# EAGLE schematic TermProject (EAGLE 9.6.1)

## Sheet 1 of 2
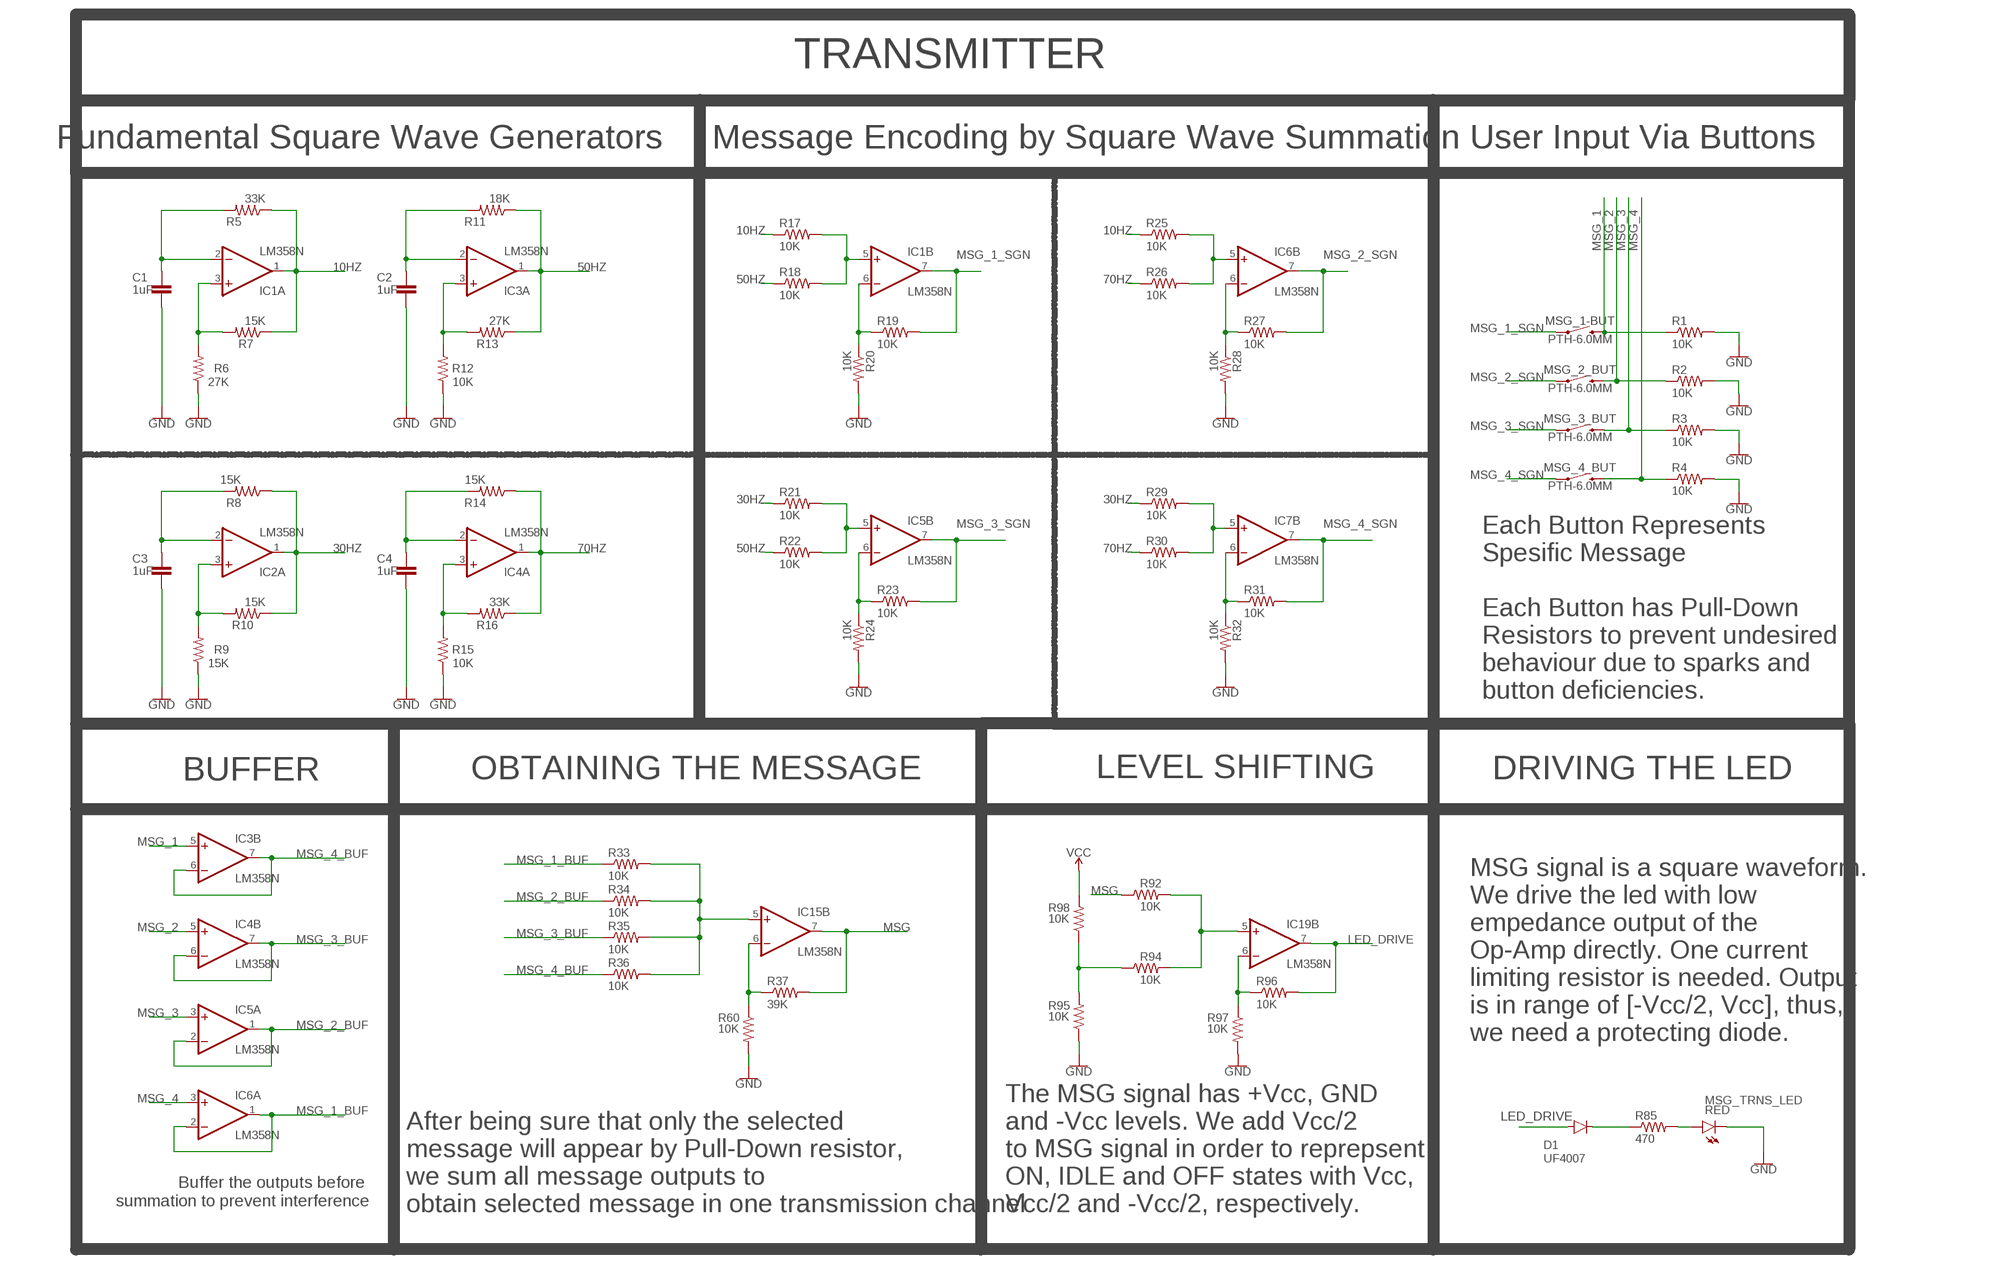
[diagram p0: schematic, sheet 1]

### Parts
C1  1uF  C-EU075-052X106  [C075-052X106]
C2  1uF  C-EU075-052X106  [C075-052X106]
C3  1uF  C-EU075-052X106  [C075-052X106]
C4  1uF  C-EU075-052X106  [C075-052X106]
D1  UF4007  1N4148DO35-7  [DO35-7]
IC1  LM358N  [DIL08]
IC2  LM358N  [DIL08]
IC3  LM358N  [DIL08]
IC4  LM358N  [DIL08]
IC5  LM358N  [DIL08]
IC6  LM358N  [DIL08]
IC7  LM358N  [DIL08]
IC15  LM358N  [DIL08]
IC19  LM358N  [DIL08]
MSG_1-BUT  PTH-6.0MM  MOMENTARY-SWITCH-SPST-PTH-6.0MM  [TACTILE_SWITCH_PTH_6.0MM]
MSG_2_BUT  PTH-6.0MM  MOMENTARY-SWITCH-SPST-PTH-6.0MM  [TACTILE_SWITCH_PTH_6.0MM]
MSG_3_BUT  PTH-6.0MM  MOMENTARY-SWITCH-SPST-PTH-6.0MM  [TACTILE_SWITCH_PTH_6.0MM]
MSG_4_BUT  PTH-6.0MM  MOMENTARY-SWITCH-SPST-PTH-6.0MM  [TACTILE_SWITCH_PTH_6.0MM]
MSG_TRNS_LED  RED  LED10MM  [LED_10MM]
R1  10K  R-US_0207/7  [0207/7]
R2  10K  R-US_0207/7  [0207/7]
R3  10K  R-US_0207/7  [0207/7]
R4  10K  R-US_0207/7  [0207/7]
R5  33K  R-US_0207/7  [0207/7]
R6  27K  R-US_0207/7  [0207/7]
R7  15K  R-US_0207/7  [0207/7]
R8  15K  R-US_0207/7  [0207/7]
R9  15K  R-US_0207/7  [0207/7]
R10  15K  R-US_0207/7  [0207/7]
R11  18K  R-US_0207/7  [0207/7]
R12  10K  R-US_0207/7  [0207/7]
R13  27K  R-US_0207/7  [0207/7]
R14  15K  R-US_0207/7  [0207/7]
R15  10K  R-US_0207/7  [0207/7]
R16  33K  R-US_0207/7  [0207/7]
R17  10K  R-US_0207/7  [0207/7]
R18  10K  R-US_0207/7  [0207/7]
R19  10K  R-US_0207/7  [0207/7]
R20  10K  R-US_0207/7  [0207/7]
R21  10K  R-US_0207/7  [0207/7]
R22  10K  R-US_0207/7  [0207/7]
R23  10K  R-US_0207/7  [0207/7]
R24  10K  R-US_0207/7  [0207/7]
R25  10K  R-US_0207/7  [0207/7]
R26  10K  R-US_0207/7  [0207/7]
R27  10K  R-US_0207/7  [0207/7]
R28  10K  R-US_0207/7  [0207/7]
R29  10K  R-US_0207/7  [0207/7]
R30  10K  R-US_0207/7  [0207/7]
R31  10K  R-US_0207/7  [0207/7]
R32  10K  R-US_0207/7  [0207/7]
R33  10K  R-US_0207/7  [0207/7]
R34  10K  R-US_0207/7  [0207/7]
R35  10K  R-US_0207/7  [0207/7]
R36  10K  R-US_0207/7  [0207/7]
R37  39K  R-US_0207/7  [0207/7]
R60  10K  R-US_0207/7  [0207/7]
R85  470  R-US_0207/7  [0207/7]
R92  10K  R-US_0207/7  [0207/7]
R94  10K  R-US_0207/7  [0207/7]
R95  10K  R-US_0207/7  [0207/7]
R96  10K  R-US_0207/7  [0207/7]
R97  10K  R-US_0207/7  [0207/7]
R98  10K  R-US_0207/7  [0207/7]

### Nets
10HZ: IC1.1(A:OUT) R5.1 R7.1 R17.1 R25.1
30HZ: IC2.1(A:OUT) R8.1 R10.1 R21.1 R29.1
50HZ: IC3.1(A:OUT) R11.1 R13.1 R18.1 R22.1
70HZ: IC4.1(A:OUT) R14.1 R16.1 R26.1 R30.1
GND: C1.1 C2.1 C3.1 C4.1 MSG_TRNS_LED.C R1.2 R2.2 R3.2 R4.2 R6.1 R9.1 R12.1 R15.1 R20.2 R24.2 R28.2 R32.2 R60.2 R95.1 R97.2 ; also sheet 2
LED_DRIVE: D1.A IC19.7(B:OUT) R96.2
MSG: IC15.7(B:OUT) R37.2 R92.1
MSG_1: IC3.5(B:+IN) MSG_1-BUT.3 R1.1
MSG_1_BUF: IC6.1(A:OUT) IC6.2(A:-IN) R33.1
MSG_1_SGN: IC1.7(B:OUT) MSG_1-BUT.1 R19.2
MSG_2: IC4.5(B:+IN) MSG_2_BUT.3 R2.1
MSG_2_BUF: IC5.1(A:OUT) IC5.2(A:-IN) R34.1
MSG_2_SGN: IC6.7(B:OUT) MSG_2_BUT.1 R27.2
MSG_3: IC5.3(A:+IN) MSG_3_BUT.3 R3.1
MSG_3_BUF: IC4.6(B:-IN) IC4.7(B:OUT) R35.1
MSG_3_SGN: IC5.7(B:OUT) MSG_3_BUT.1 R23.2
MSG_4: IC6.3(A:+IN) MSG_4_BUT.3 R4.1
MSG_4_BUF: IC3.6(B:-IN) IC3.7(B:OUT) R36.1
MSG_4_SGN: IC7.7(B:OUT) MSG_4_BUT.1 R31.2
N$1: C1.2 IC1.2(A:-IN) R5.2
N$2: C3.2 IC2.2(A:-IN) R8.2
N$3: IC1.3(A:+IN) R6.2 R7.2
N$4: IC2.3(A:+IN) R9.2 R10.2
N$5: C2.2 IC3.2(A:-IN) R11.2
N$6: IC3.3(A:+IN) R12.2 R13.2
N$7: C4.2 IC4.2(A:-IN) R14.2
N$8: IC4.3(A:+IN) R15.2 R16.2
N$9: IC1.5(B:+IN) R17.2 R18.2
N$10: IC1.6(B:-IN) R19.1 R20.1
N$11: IC5.5(B:+IN) R21.2 R22.2
N$12: IC5.6(B:-IN) R23.1 R24.1
N$13: IC6.5(B:+IN) R25.2 R26.2
N$14: IC6.6(B:-IN) R27.1 R28.1
N$15: IC7.5(B:+IN) R29.2 R30.2
N$16: IC7.6(B:-IN) R31.1 R32.1
N$17: D1.C R85.1
N$30: IC15.6(B:-IN) R37.1 R60.1
N$33: IC15.5(B:+IN) R33.2 R34.2 R35.2 R36.2
N$58: MSG_TRNS_LED.A R85.2
N$64: IC19.6(B:-IN) R96.1 R97.1
N$68: R94.1 R95.2 R98.1
N$69: IC19.5(B:+IN) R92.2 R94.2
VCC: R98.2 ; also sheet 2
Unconnected: IC2.5(B:+IN) IC2.6(B:-IN) IC2.7(B:OUT) IC7.1(A:OUT) IC7.2(A:-IN) IC7.3(A:+IN) IC15.1(A:OUT) IC15.2(A:-IN) IC15.3(A:+IN) IC19.1(A:OUT) IC19.2(A:-IN) IC19.3(A:+IN)

### Notes on the sheet
- TRANSMITTER
- Fundamental Square Wave Generators | Message Encoding by Square Wave Summation | User Input Via Buttons
- Each Button Represents 
  Spesific Message
  
  Each Button has Pull-Down 
  Resistors to prevent undesired
  behaviour due to sparks and 
  button deficiencies.
- BUFFER | OBTAINING THE MESSAGE | LEVEL SHIFTING | DRIVING THE LED
- MSG signal is a square waveform. 
  We drive the led with low 
  empedance output of the 
  Op-Amp directly. One current 
  limiting resistor is needed. Output 
  is in range of [-Vcc/2, Vcc], thus, 
  we need a protecting diode.
- Buffer the outputs before 
  summation to prevent interference
- After being sure that only the selected 
  message will appear by Pull-Down resistor, 
  we sum all message outputs to 
  obtain selected message in one transmission channel
- The MSG signal has +Vcc, GND 
  and -Vcc levels. We add Vcc/2
  to MSG signal in order to reprepsent 
  ON, IDLE and OFF states with Vcc, 
  Vcc/2 and -Vcc/2, respectively.

## Sheet 2 of 2
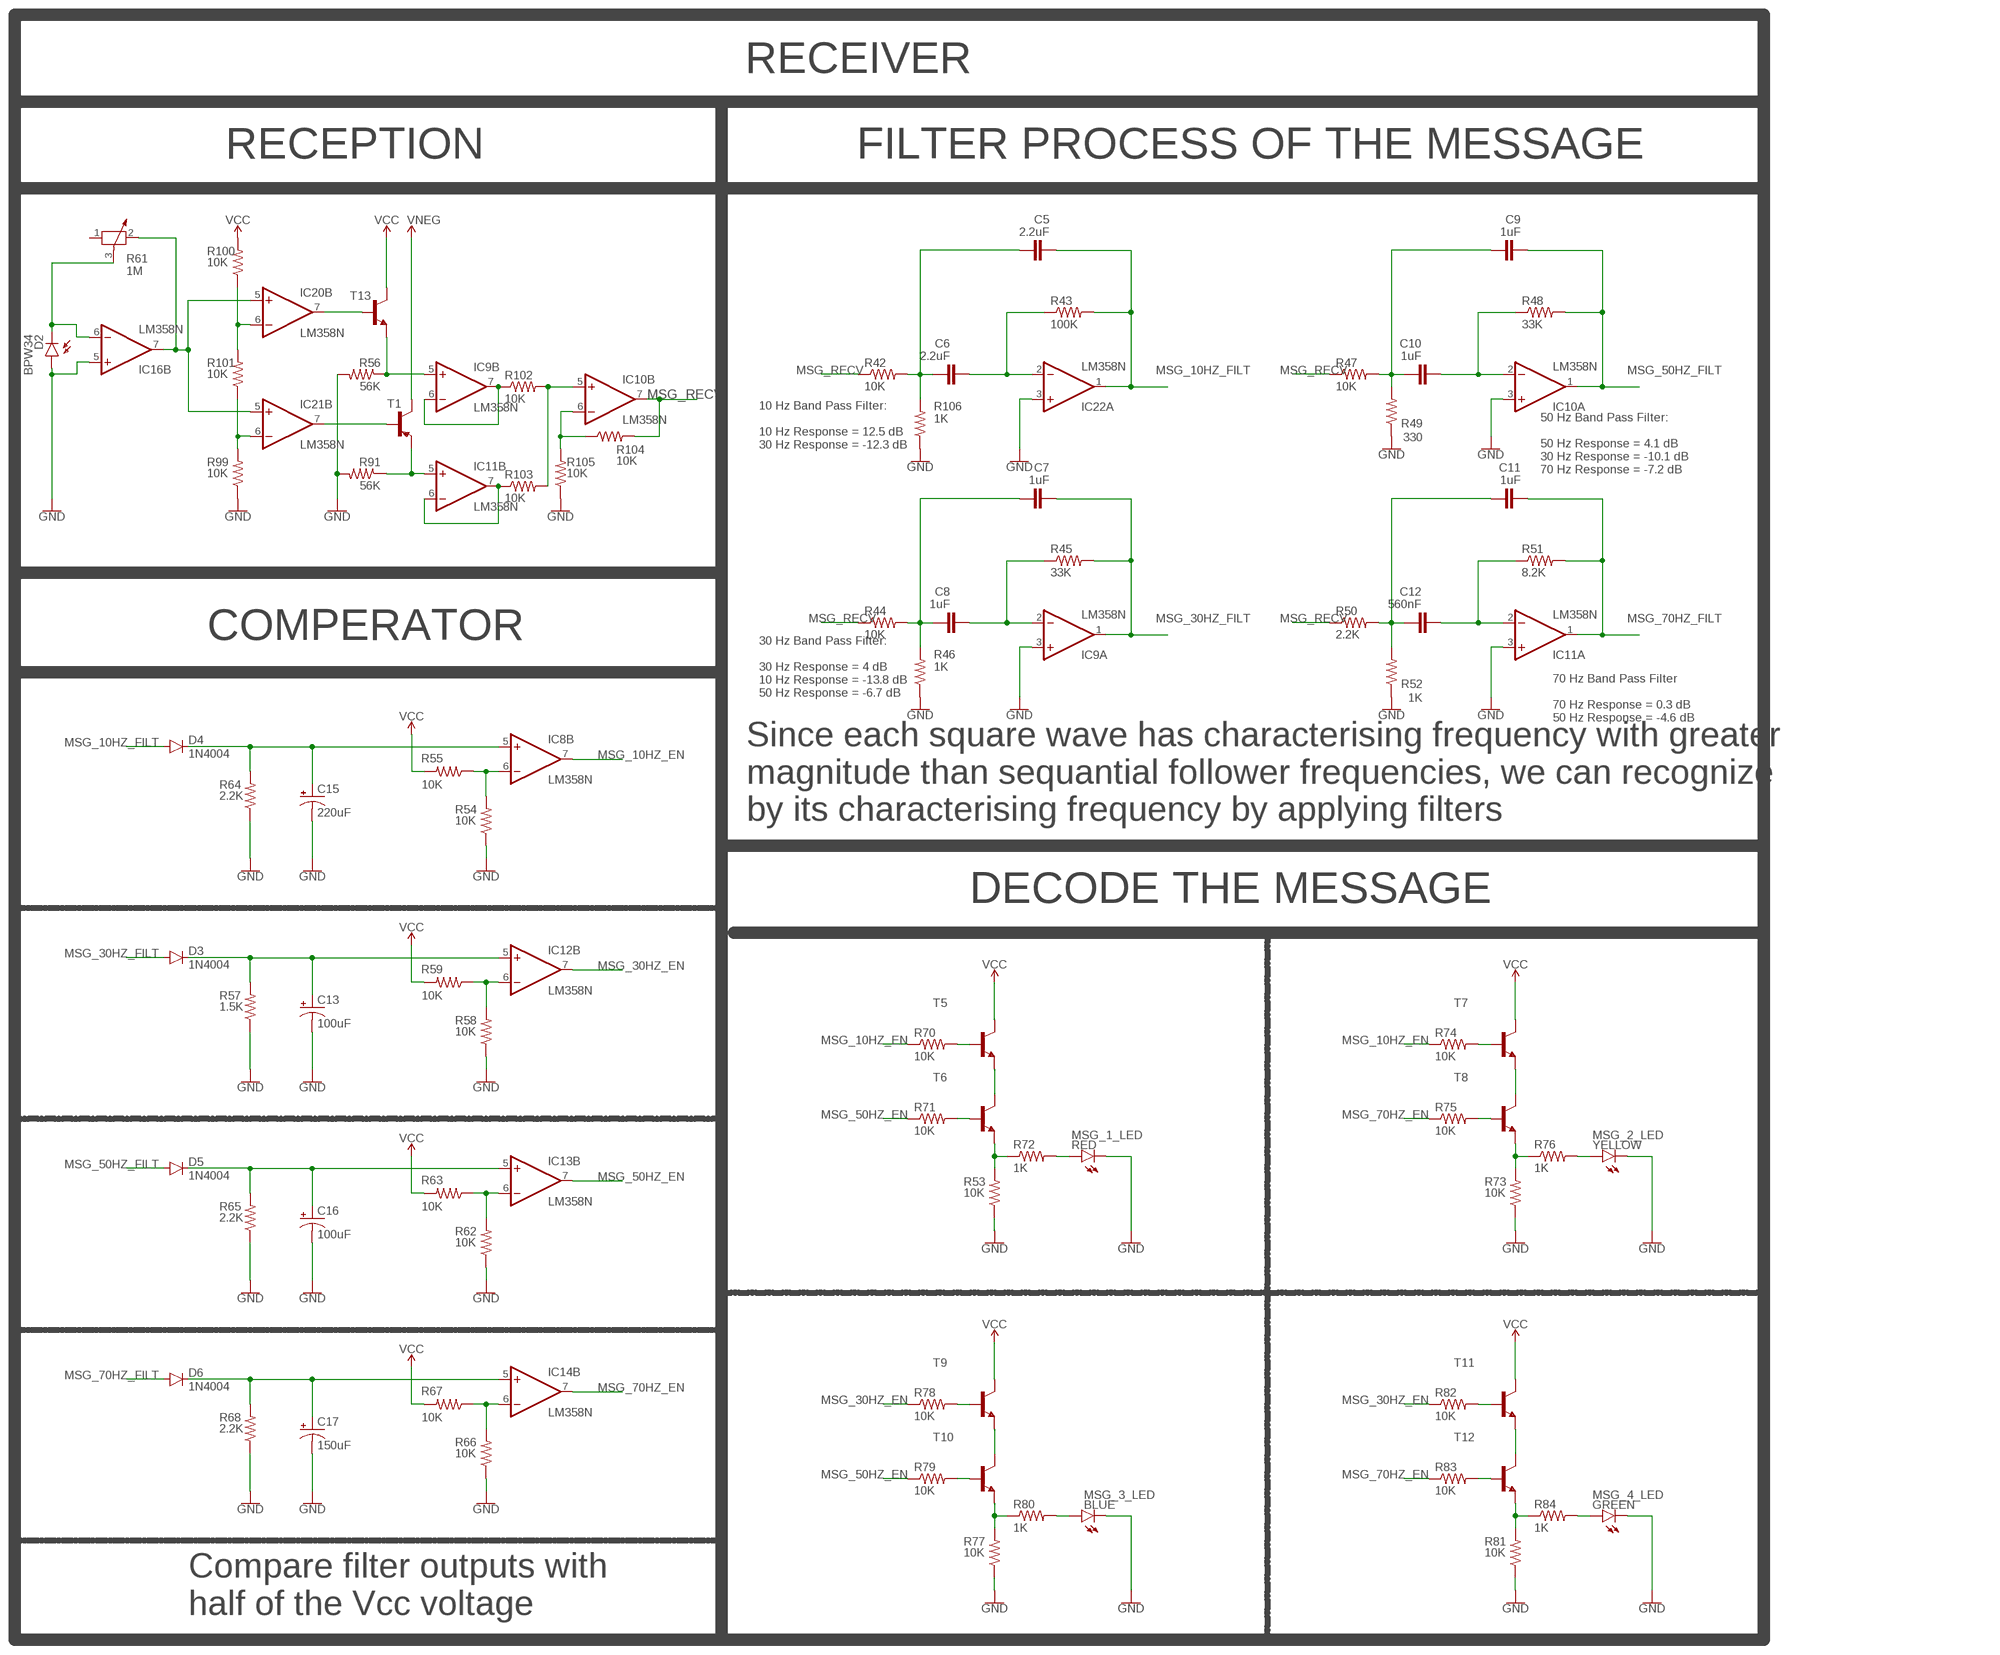
[diagram p1: schematic, sheet 2]

### Parts
C5  2.2uF  C-EU075-052X106  [C075-052X106]
C6  2.2uF  C-EU075-052X106  [C075-052X106]
C7  1uF  C-EU075-052X106  [C075-052X106]
C8  1uF  C-EU075-052X106  [C075-052X106]
C9  1uF  C-EU075-052X106  [C075-052X106]
C10  1uF  C-EU075-052X106  [C075-052X106]
C11  1uF  C-EU075-052X106  [C075-052X106]
C12  560nF  C-EU075-052X106  [C075-052X106]
C13  100uF  CPOL-USE5-10.5  [E5-10,5]
C15  220uF  CPOL-USE5-10.5  [E5-10,5]
C16  100uF  CPOL-USE5-10.5  [E5-10,5]
C17  150uF  CPOL-USE5-10.5  [E5-10,5]
D2  BPW34  BPW32  [BPW32]
D3  1N4004  [DO41-10]
D4  1N4004  [DO41-10]
D5  1N4004  [DO41-10]
D6  1N4004  [DO41-10]
IC8  LM358N  [DIL08]
IC9  LM358N  [DIL08]
IC10  LM358N  [DIL08]
IC11  LM358N  [DIL08]
IC12  LM358N  [DIL08]
IC13  LM358N  [DIL08]
IC14  LM358N  [DIL08]
IC16  LM358N  [DIL08]
IC20  LM358N  [DIL08]
IC21  LM358N  [DIL08]
IC22  LM358N  [DIL08]
MSG_1_LED  RED  LED10MM  [LED_10MM]
MSG_2_LED  YELLOW  LED10MM  [LED_10MM]
MSG_3_LED  BLUE  LED10MM  [LED_10MM]
MSG_4_LED  GREEN  LED10MM  [LED_10MM]
R42  10K  R-US_0207/7  [0207/7]
R43  100K  R-US_0207/7  [0207/7]
R44  10K  R-US_0207/7  [0207/7]
R45  33K  R-US_0207/7  [0207/7]
R46  1K  R-US_0207/7  [0207/7]
R47  10K  R-US_0207/7  [0207/7]
R48  33K  R-US_0207/7  [0207/7]
R49  330  R-US_0207/7  [0207/7]
R50  2.2K  R-US_0207/7  [0207/7]
R51  8.2K  R-US_0207/7  [0207/7]
R52  1K  R-US_0207/7  [0207/7]
R53  10K  R-US_0207/7  [0207/7]
R54  10K  R-US_0207/7  [0207/7]
R55  10K  R-US_0207/7  [0207/7]
R56  56K  R-US_0207/7  [0207/7]
R57  1.5K  R-US_0207/7  [0207/7]
R58  10K  R-US_0207/7  [0207/7]
R59  10K  R-US_0207/7  [0207/7]
R61  1M  POTENTIOMETER_PT-10S  [PT-10S]
R62  10K  R-US_0207/7  [0207/7]
R63  10K  R-US_0207/7  [0207/7]
R64  2.2K  R-US_0207/7  [0207/7]
R65  2.2K  R-US_0207/7  [0207/7]
R66  10K  R-US_0207/7  [0207/7]
R67  10K  R-US_0207/7  [0207/7]
R68  2.2K  R-US_0207/7  [0207/7]
R70  10K  R-US_0207/7  [0207/7]
R71  10K  R-US_0207/7  [0207/7]
R72  1K  R-US_0207/7  [0207/7]
R73  10K  R-US_0207/7  [0207/7]
R74  10K  R-US_0207/7  [0207/7]
R75  10K  R-US_0207/7  [0207/7]
R76  1K  R-US_0207/7  [0207/7]
R77  10K  R-US_0207/7  [0207/7]
R78  10K  R-US_0207/7  [0207/7]
R79  10K  R-US_0207/7  [0207/7]
R80  1K  R-US_0207/7  [0207/7]
R81  10K  R-US_0207/7  [0207/7]
R82  10K  R-US_0207/7  [0207/7]
R83  10K  R-US_0207/7  [0207/7]
R84  1K  R-US_0207/7  [0207/7]
R91  56K  R-US_0207/7  [0207/7]
R99  10K  R-US_0207/7  [0207/7]
R100  10K  R-US_0207/7  [0207/7]
R101  10K  R-US_0207/7  [0207/7]
R102  10K  R-US_0207/7  [0207/7]
R103  10K  R-US_0207/7  [0207/7]
R104  10K  R-US_0207/7  [0207/7]
R105  10K  R-US_0207/7  [0207/7]
R106  1K  R-US_0207/7  [0207/7]
T1  BC807-40-PNP-SOT23-BEC  [SOT23-BEC]
T5  -NPN-TO92-CBE  [TO92-CBE]
T6  -NPN-TO92-CBE  [TO92-CBE]
T7  -NPN-TO92-CBE  [TO92-CBE]
T8  -NPN-TO92-CBE  [TO92-CBE]
T9  -NPN-TO92-CBE  [TO92-CBE]
T10  -NPN-TO92-CBE  [TO92-CBE]
T11  -NPN-TO92-CBE  [TO92-CBE]
T12  -NPN-TO92-CBE  [TO92-CBE]
T13  -NPN-TO92-CBE  [TO92-CBE]

### Nets
GND: C13.- C15.- C16.- C17.- D2.A IC9.3(A:+IN) IC10.3(A:+IN) IC11.3(A:+IN) IC16.5(B:+IN) IC22.3(A:+IN) MSG_1_LED.C MSG_2_LED.C MSG_3_LED.C MSG_4_LED.C R46.1 R49.1 R52.1 R53.1 R54.1 R56.2 R57.1 R58.1 R62.1 R64.1 R65.1 R66.1 R68.1 R73.1 R77.1 R81.1 R91.2 R99.1 R105.1 R106.1 ; also sheet 1
INTENSİTY: IC16.7(B:OUT) IC20.5(B:+IN) IC21.5(B:+IN) R61.2
MSG_10HZ_EN: IC8.7(B:OUT) R70.1 R74.1
MSG_10HZ_FILT: D4.A
MSG_30HZ_EN: IC12.7(B:OUT) R78.1 R82.1
MSG_30HZ_FILT: C7.2 D3.A IC9.1(A:OUT) R45.2
MSG_30HZ_FILT1: C5.2 IC22.1(A:OUT) R43.2
MSG_50HZ_EN: IC13.7(B:OUT) R71.1 R79.1
MSG_50HZ_FILT: C9.2 D5.A IC10.1(A:OUT) R48.2
MSG_70HZ_EN: IC14.7(B:OUT) R75.1 R83.1
MSG_70HZ_FILT: C11.2 D6.A IC11.1(A:OUT) R51.2
MSG_NEG_OUT: IC9.5(B:+IN) R56.1 T13.E
MSG_RECV: IC10.7(B:OUT) R42.1 R44.1 R47.1 R50.1 R104.2
N$18: C6.2 IC22.2(A:-IN) R43.1
N$19: C5.1 C6.1 R42.2 R106.2
N$20: C10.2 IC10.2(A:-IN) R48.1
N$21: C8.2 IC9.2(A:-IN) R45.1
N$22: C7.1 C8.1 R44.2 R46.2
N$23: C9.1 C10.1 R47.2 R49.2
N$24: C12.2 IC11.2(A:-IN) R51.1
N$25: C11.1 C12.1 R50.2 R52.2
N$26: R70.2 T5.B
N$27: T5.E T6.C
N$28: R53.2 R72.1 T6.E
N$29: R71.2 T6.B
N$31: IC8.6(B:-IN) R54.2 R55.1
N$32: IC12.6(B:-IN) R58.2 R59.1
N$34: IC20.7(B:OUT) T13.B
N$35: C15.+ D4.C IC8.5(B:+IN) R64.2
N$36: IC13.6(B:-IN) R62.2 R63.1
N$37: IC20.6(B:-IN) R100.1 R101.2
N$38: D2.K(C) IC16.6(B:-IN) R61.3
N$39: IC14.6(B:-IN) R66.2 R67.1
N$40: C13.+ D3.C IC12.5(B:+IN) R57.2
N$41: C16.+ D5.C IC13.5(B:+IN) R65.2
N$42: MSG_1_LED.A R72.2
N$43: T7.E T8.C
N$44: R73.2 R76.1 T8.E
N$45: R74.2 T7.B
N$46: R75.2 T8.B
N$47: MSG_2_LED.A R76.2
N$48: T9.E T10.C
N$49: R77.2 R80.1 T10.E
N$50: R78.2 T9.B
N$51: R79.2 T10.B
N$52: MSG_3_LED.A R80.2
N$53: T11.E T12.C
N$54: R81.2 R84.1 T12.E
N$55: R82.2 T11.B
N$56: R83.2 T12.B
N$57: MSG_4_LED.A R84.2
N$59: C17.+ D6.C IC14.5(B:+IN) R68.2
N$62: IC21.6(B:-IN) R99.2 R101.1
N$63: IC10.6(B:-IN) R104.1 R105.2
N$65: IC21.7(B:OUT) T1.B
N$66: IC11.5(B:+IN) R91.1 T1.E
N$67: IC10.5(B:+IN) R102.2 R103.2
N$70: IC9.6(B:-IN) IC9.7(B:OUT) R102.1
N$71: IC11.6(B:-IN) IC11.7(B:OUT) R103.1
VCC: R55.2 R59.2 R63.2 R67.2 R100.2 T5.C T7.C T9.C T11.C T13.C ; also sheet 1
VNEG: T1.C
Unconnected: IC8.1(A:OUT) IC8.2(A:-IN) IC8.3(A:+IN) IC12.1(A:OUT) IC12.2(A:-IN) IC12.3(A:+IN) IC13.1(A:OUT) IC13.2(A:-IN) IC13.3(A:+IN) IC14.1(A:OUT) IC14.2(A:-IN) IC14.3(A:+IN) IC16.1(A:OUT) IC16.2(A:-IN) IC16.3(A:+IN) IC20.1(A:OUT) IC20.2(A:-IN) IC20.3(A:+IN) IC21.1(A:OUT) IC21.2(A:-IN) IC21.3(A:+IN) IC22.5(B:+IN) IC22.6(B:-IN) IC22.7(B:OUT) R61.1

### Notes on the sheet
- RECEIVER
- RECEPTION | FILTER PROCESS OF THE MESSAGE
- 10 Hz Band Pass Filter:
  
  10 Hz Response = 12.5 dB
  30 Hz Response = -12.3 dB
- 50 Hz Band Pass Filter:
  
  50 Hz Response = 4.1 dB
  30 Hz Response = -10.1 dB
  70 Hz Response = -7.2 dB
- COMPERATOR
- 30 Hz Band Pass Filter:
  
  30 Hz Response = 4 dB
  10 Hz Response = -13.8 dB
  50 Hz Response = -6.7 dB
- 70 Hz Band Pass Filter
  
  70 Hz Response = 0.3 dB
  50 Hz Response = -4.6 dB
- Since each square wave has characterising frequency with greater
  magnitude than sequantial follower frequencies, we can recognize
  by its characterising frequency by applying filters
- DECODE THE MESSAGE
- Compare filter outputs with
  half of the Vcc voltage

## Power pins joined to a net without a drawn wire
V+: IC1.8(P:V+) IC2.8(P:V+) IC3.8(P:V+) IC4.8(P:V+) IC5.8(P:V+) IC6.8(P:V+) IC7.8(P:V+) IC8.8(P:V+) IC9.8(P:V+) IC10.8(P:V+) IC11.8(P:V+) IC12.8(P:V+) IC13.8(P:V+) IC14.8(P:V+) IC15.8(P:V+) IC16.8(P:V+) IC19.8(P:V+) IC20.8(P:V+) IC21.8(P:V+) IC22.8(P:V+)
V-: IC1.4(P:V-) IC2.4(P:V-) IC3.4(P:V-) IC4.4(P:V-) IC5.4(P:V-) IC6.4(P:V-) IC7.4(P:V-) IC8.4(P:V-) IC9.4(P:V-) IC10.4(P:V-) IC11.4(P:V-) IC12.4(P:V-) IC13.4(P:V-) IC14.4(P:V-) IC15.4(P:V-) IC16.4(P:V-) IC19.4(P:V-) IC20.4(P:V-) IC21.4(P:V-) IC22.4(P:V-)

## Library data of the parts
C1-C12 = rcl:C-EU: CAPACITOR, European symbol; SPICEPREFIX: C
C13 C15-C17 = rcl:CPOL-US: POLARIZED CAPACITOR, American symbol; SPICEPREFIX: C
D1 = diode:1N4148: DIODE high speed (Philips)
D2 = opto-trans-siemens:BPW32: PHOTO DIODE; OC_FARNELL: unknown; OC_NEWARK: unknown
D3-D6 = diode:1N4004: DIODE general purpose rectifier, 1 A
IC1-IC16 IC19-IC22 = LM7805:LM358: OP AMP
MSG_1-BUT MSG_2_BUT MSG_3_BUT MSG_4_BUT = SparkFun-Switches:MOMENTARY-SWITCH-SPST: Momentary Switch (Pushbutton) - SPST Normally-open (NO) SPST momentary switches (buttons, pushbuttons). Variants PTH-12MM - 12mm square, through-hole Momentary Pushbutton Switch - 12mm Square <https://www.sparkfun.com/products/9190> (COM-09190) PTH-6.0MM, PTH-6.0MM-KIT - 6.0mm square, through-hole Mini Pushbutton Switch <https://www.sparkfun.com/products/97> (COM-00097) KIT package intended for soldering kit's - only one side of pads' copper is exposed. PTH-RIGHT-ANGLE-KIT - Right-angle, through-hole Right Angle Tactile Button <https://www.sparkfun.com/products/10791> - Used on SparkFun BigTime Watch Kit <https://www.sparkfun.com/products/11734> SMD-12MM - 12mm square, surface-mount Tactile Button - SMD (12mm) <https://www.sparkfun.com/products/12993> (COM-12993) Used on SparkFun PicoBoard <https://www.sparkfun.com/products/11888> SMD-4.5MM - 4.5mm Square Trackball Switch Used on SparkFun Blackberry Trackballer Breakout <https://www.sparkfun.com/products/13169> SMD-4.6MMX2.8MM - 4.60mm x 2.80mm, surface mount Used on SparkFun SAMD21 Mini Breakout <https://www.sparkfun.com/products/13664> SMD-5.2MM, SMD-5.2-REDUNDANT - 5.2mm square, surface-mount Mini Pushbutton Switch - SMD <https://www.sparkfun.com/products/8720> (COM-08720) Used on Arduino Pro Mini <https://www.sparkfun.com/products/11114> REDUNDANT package connects both switch circuits together SMD-6.0X3.5MM - 6.0 x 3.5mm, surface mount Momentary Reset Switch SMD <https://www.sparkfun.com/products/8229> (COM-08229) SMD-6.2MM-TALL - 6.2mm square, surface mount Tactile Button - SMD (6mm) <https://www.sparkfun.com/products/12992> Used on SparkFun Digital Sandbox <https://www.sparkfun.com/products/12651> SMD-RIGHT-ANGLE - Right-angle, surface mount Used on SparkFun Block for Intel® Edison - Arduino <https://www.sparkfun.com/products/13036>; PROD_ID: SWCH-08441; SF_SKU: COM-00097
MSG_1_LED MSG_2_LED MSG_3_LED MSG_4_LED MSG_TRNS_LED = SparkFun-LED:LED: LED (Generic) Standard schematic elements and footprints for 5mm, 3mm, 1206, and 0603 sized LEDs. Generic LEDs with no color specified.
R1-R37 R42-R60 R62-R68 R70-R85 R91 R92 R94-R106 = rcl:R-US_: RESISTOR, American symbol; SPICEPREFIX: R
R61 = rcl:POTENTIOMETER_: Potentiometer; SPICEMODEL: POT; SPICEPREFIX: X
T1 = transistor-neu-to92:*-PNP-: PNP Transistror
T5-T13 = transistor-neu-to92:*-NPN-: NPN Transistror